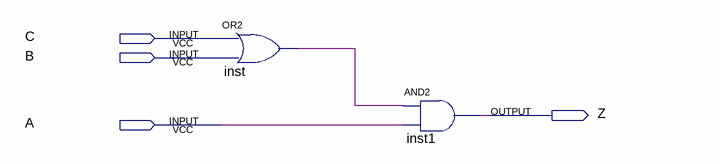
[diagram p0: schematic sheet]
// Quartus schematic Ex2.bdf as structural Verilog: 2 symbols, 4 pins
module Ex2 (
  input  C,
  input  B,
  input  A,
  output Z
);

  wire inst_out;

  or inst (inst_out, C, B);
  and inst1 (Z, inst_out, A);
endmodule
